# EAGLE design rpiz_test (EAGLE 7.7.0)
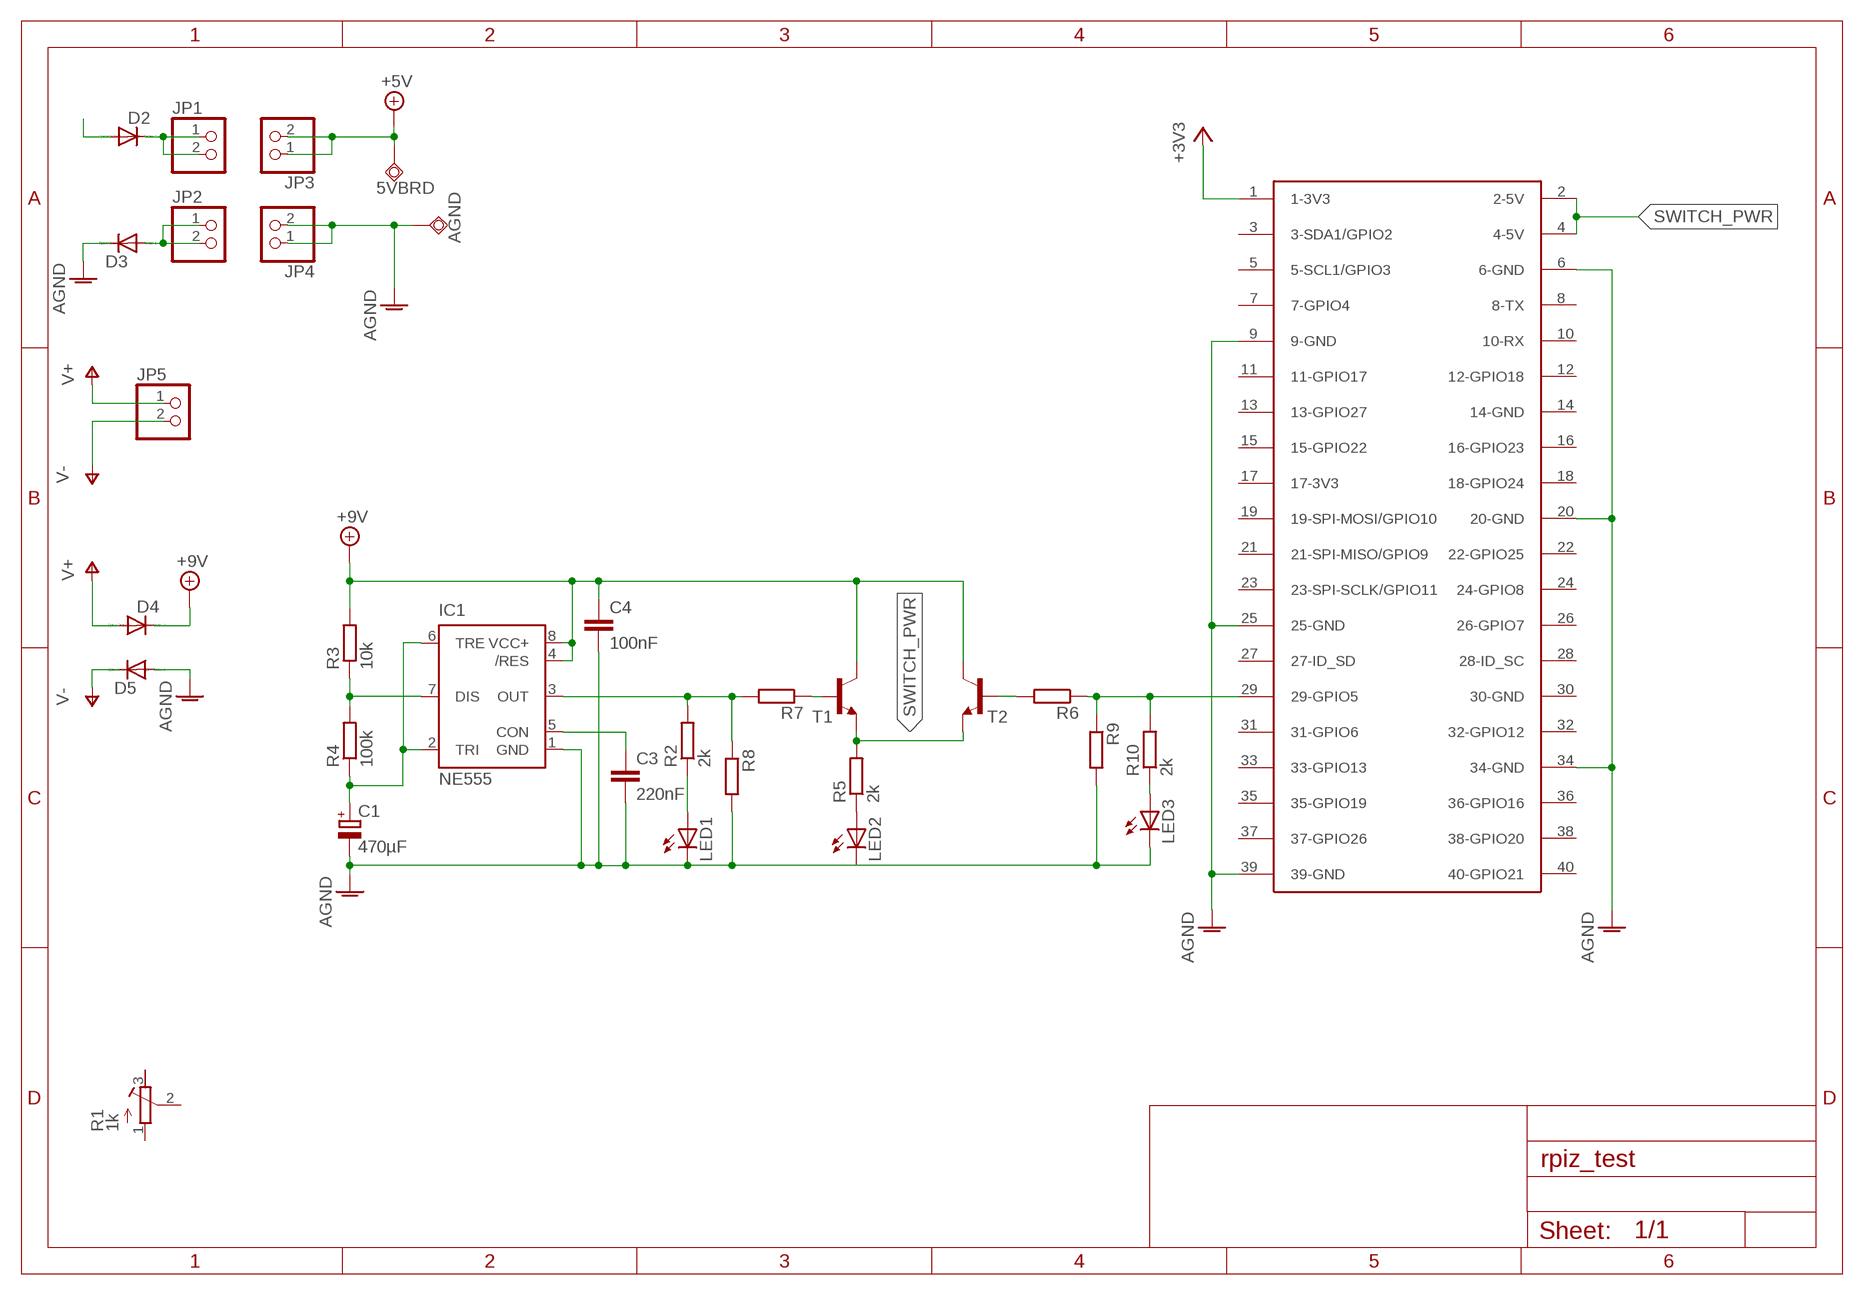
[diagram p0: schematic, sheet 1]

## Parts
5VBRD  TPSQTP20SQ  [TP20SQ]
AGND  TPSQTP20SQ  [TP20SQ]
C1  470µF  CPOL-EUE5-10.5  [E5-10,5]
C3  220nF  C-EU050-030X075  [C050-030X075]
C4  100nF  C-EU050-030X075  [C050-030X075]
D2  1N4148DO35-7  [DO35-7]
D3  1N4148DO35-7  [DO35-7]
D4  1N4148DO35-7  [DO35-7]
D5  1N4148DO35-7  [DO35-7]
IC1  NE555  [DIL-08]
JP1  PINHD-1X2  [1X02]
JP2  PINHD-1X2  [1X02]
JP3  PINHD-1X2  [1X02]
JP4  PINHD-1X2  [1X02]
JP5  PINHD-1X2  [1X02]
LED1  LED5MM  [LED5MM]
LED2  LED5MM  [LED5MM]
LED3  LED5MM  [LED5MM]
R1  1k  R-TRIMM64W  [RTRIM64W]
R2  2k  R-EU_0207/10  [0207/10]
R3  10k  R-EU_0207/10  [0207/10]
R4  100k  R-EU_0207/10  [0207/10]
R5  2k  R-EU_0207/10  [0207/10]
R6  R-EU_R0805  [R0805]
R7  R-EU_R0805  [R0805]
R8  R-EU_R0805  [R0805]
R9  R-EU_R0805  [R0805]
R10  2k  R-EU_0207/10  [0207/10]
T1  BC547-NPN-TO92-CBE  [TO92-CBE]
T2  BC547-NPN-TO92-CBE  [TO92-CBE]
U$1  RASPBERRY-PI+PIZERO  [RASPBERRY-PI-ZERO]

## Nets
+3V3: U$1.1(1-3V3)
+5V: 5VBRD.TP JP3.1 JP3.2
+9V: C4.1 D4.C IC1.4(/RES) IC1.8(VCC+) R3.2 T1.C T2.C
AGND: AGND.TP C1.- C3.2 C4.2 D3.C D5.A IC1.1(GND) JP4.1 JP4.2 LED1.K(C) LED2.K(C) LED3.K(C) R8.2 R9.2 U$1.6(6-GND) U$1.9(9-GND) U$1.20(20-GND) U$1.25(25-GND) U$1.34(34-GND) U$1.39(39-GND)
GPA0: IC1.3(OUT) R2.2 R7.2 R8.1
N$1: D2.C JP1.1 JP1.2
N$2: D3.A JP2.1 JP2.2
N$3: IC1.7(DIS) R3.1 R4.2
N$4: C1.+ IC1.2(TRI) IC1.6(TRE) R4.1
N$5: LED2.A R5.1
N$6: C3.1 IC1.5(CON)
N$7: R7.1 T1.B
N$8: D2.A
N$9: LED1.A R2.1
N$10: R6.2 T2.B
N$11: R6.1 R9.1 R10.2 U$1.29(29-GPIO5)
N$13: LED3.A R10.1
SWITCH_PWR: R5.2 T1.E T2.E U$1.2(2-5V) U$1.4(4-5V)
V+: D4.A JP5.1
V-: D5.C JP5.2
Unconnected: R1.1(A) R1.2(S) R1.3(E) U$1.3(3-SDA1/GPIO2) U$1.5(5-SCL1/GPIO3) U$1.7(7-GPIO4) U$1.8(8-TX) U$1.10(10-RX) U$1.11(11-GPIO17) U$1.12(12-GPIO18) U$1.13(13-GPIO27) U$1.14(14-GND) U$1.15(15-GPIO22) U$1.16(16-GPIO23) U$1.17(17-3V3) U$1.18(18-GPIO24) U$1.19(19-SPI-MOSI/GPIO10) U$1.21(21-SPI-MISO/GPIO9) U$1.22(22-GPIO25) U$1.23(23-SPI-SCLK/GPIO11) U$1.24(24-GPIO8) U$1.26(26-GPIO7) U$1.27(27-ID_SD) U$1.28(28-ID_SC) U$1.30(30-GND) U$1.31(31-GPIO6) U$1.32(32-GPIO12) U$1.33(33-GPIO13) U$1.35(35-GPIO19) U$1.36(36-GPIO16) U$1.37(37-GPIO26) U$1.38(38-GPIO20) U$1.40(40-GPIO21)

## Library data of the parts
5VBRD AGND = testpad:TPSQ: Test pad
C1 = rcl:CPOL-EU: POLARIZED CAPACITOR, European symbol
C3 C4 = rcl:C-EU: CAPACITOR, European symbol
D2-D5 = diode:1N4148: DIODE high speed (Philips)
IC1 = st-microelectronics:NE555: General purpose bipolar Timer; MF: Arrow Electronics; MPN: NE555N; OC_FARNELL: 1467742; OC_NEWARK: 89K1486
JP1-JP5 = pinhead:PINHD-1X2: PIN HEADER
LED1-LED3 = led:LED: LED OSRAM: - CHIPLED LG R971, LG N971, LY N971, LG Q971, LY Q971, LO R971, LY R971 LH N974, LH R974 LS Q976, LO Q976, LY Q976 LO Q996 - Hyper CHIPLED LW Q18S LB Q993, LB Q99A, LB R99A - SideLED LS A670, LO A670, LY A670, LG A670, LP A670 LB A673, LV A673, LT A673, LW A673 LH A674 LY A675 LS A676, LA A676, LO A676, LY A676, LW A676 LS A679, LY A679, LG A679 - Hyper Micro SIDELED® LS Y876, LA Y876, LO Y876, LY Y876 LT Y87S - SmartLED LW L88C, LW L88S LB L89C, LB L89S, LG L890 LS L89K, LO L89K, LY L89K LS L896, LA L896, LO L896, LY L896 - TOPLED LS T670, LO T670, LY T670, LG T670, LP T670 LSG T670, LSP T670, LSY T670, LOP T670, LYG T670 LG T671, LOG T671, LSG T671 LB T673, LV T673, LT T673, LW T673 LH T674 LS T676, LA T676, LO T676, LY T676, LB T676, LH T676, LSB T676, LW T676 LB T67C, LV T67C, LT T67C, LS T67K, LO T67K, LY T67K, LW E67C LS E67B, LA E67B, LO E67B, LY E67B, LB E67C, LV E67C, LT E67C LW T67C LS T679, LY T679, LG T679 LS T770, LO T770, LY T770, LG T770, LP T770 LB T773, LV T773, LT T773, LW T773 LH T774 LS E675, LA E675, LY E675, LS T675 LS T776, LA T776, LO T776, LY T776, LB T776 LHGB T686 LT T68C, LB T68C - Hyper Mini TOPLED® LB M676 - Mini TOPLED Santana® LG M470 LS M47K, LO M47K, LY M47K Source: http://www.osram.convergy.de LUXEON: - LUMILED® LXK2-PW12-R00, LXK2-PW12-S00, LXK2-PW14-U00, LXK2-PW14-V00 LXK2-PM12-R00, LXK2-PM12-S00, LXK2-PM14-U00 LXK2-PE12-Q00, LXK2-PE12-R00, LXK2-PE12-S00, LXK2-PE14-T00, LXK2-PE14-U00 LXK2-PB12-K00, LXK2-PB12-L00, LXK2-PB12-M00, LXK2-PB14-N00, LXK2-PB14-P00, LXK2-PB14-Q00 LXK2-PR12-L00, LXK2-PR12-M00, LXK2-PR14-Q00, LXK2-PR14-R00 LXK2-PD12-Q00, LXK2-PD12-R00, LXK2-PD12-S00 LXK2-PH12-R00, LXK2-PH12-S00 LXK2-PL12-P00, LXK2-PL12-Q00, LXK2-PL12-R00 Source: www.luxeon.com KINGBRIGHT: KA-3528ASYC Source: www.kingbright.com
R1 = rcl:R-TRIMM: Trimm resistor
R2-R10 = rcl:R-EU_: RESISTOR, European symbol
T1 T2 = transistor:*-NPN-: NPN Transistror BF959 corrected 2008.03.06
U$1 = Ava:RASPBERRY-PI+: Samtec SSW-120-01-T-D

## Board
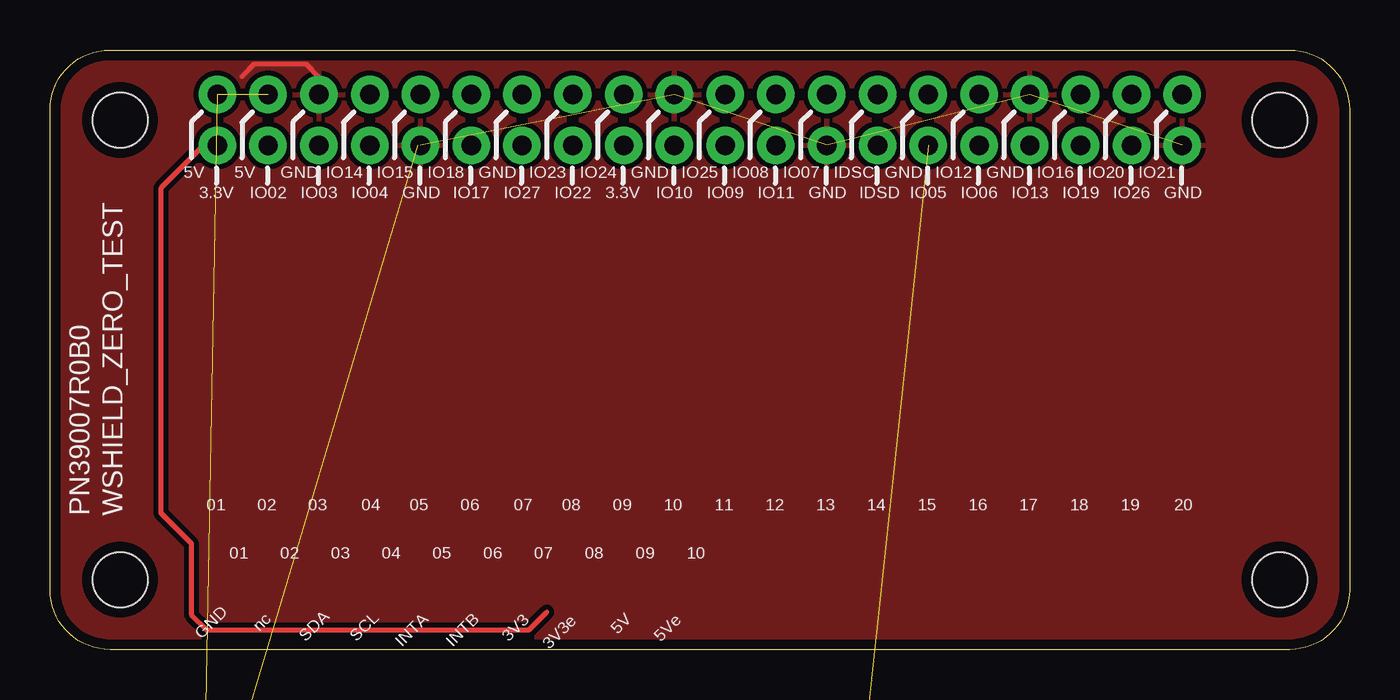
[diagram p1: board, top side]
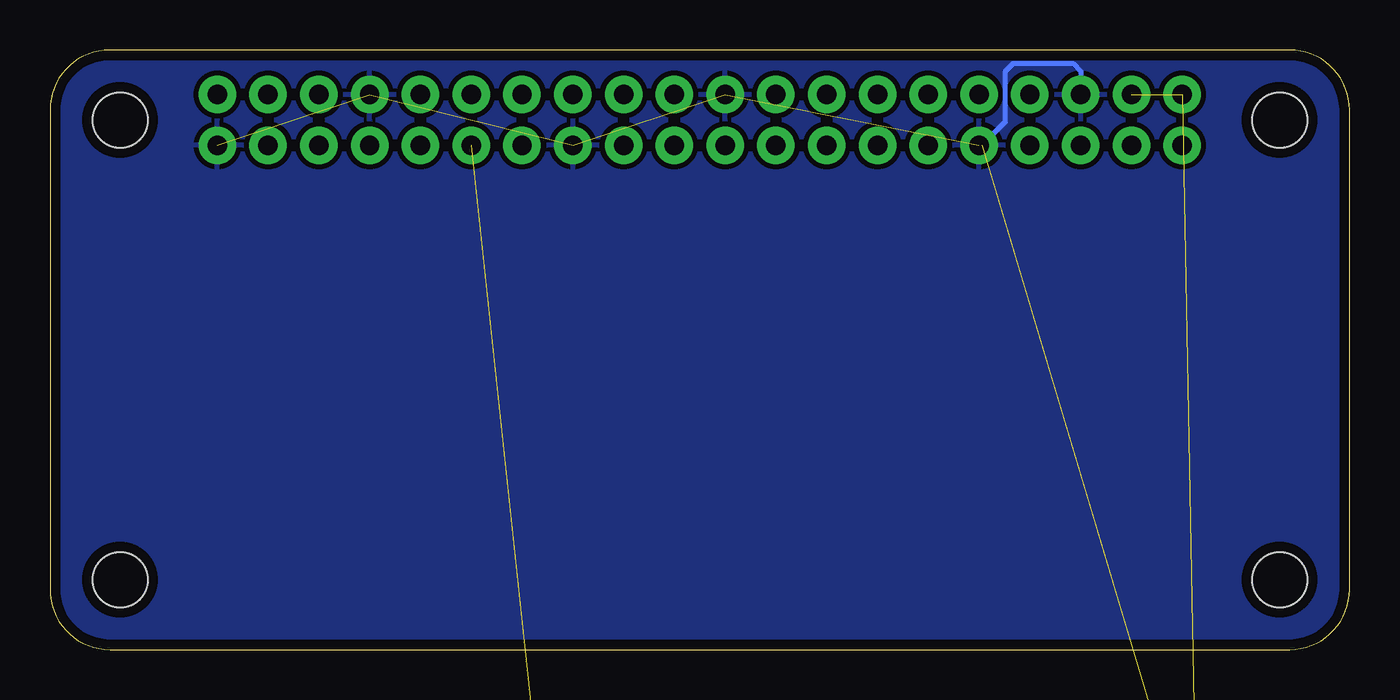
[diagram p2: board, bottom side, seen from below]

Size 65 x 30 mm. Coordinates in mm from the lower left corner, seen from the top.
Copper layers (1*16): Top 0.035mm / dielectric 1.6mm / Bottom 0.035mm
Design rules "Elecrow_2-layer_PCB_eagle_rule": minimum track width 6mil, minimum drill 12mil, track to track 6mil, track to pad 6mil, pad to pad 6mil, via to via 8mil, smd to smd 0mil, copper to edge 20mil, drill to drill 10mil, minimum pad ring 6mil, minimum via ring 6mil, stop-mask expansion 0mil, vias tented up to drill 100mil, thermal gap 10mil

### Footprints (pad centres in the part's own frame; a part is rotated, then mirrored left to right if it is on the bottom)
TP20SQ = smd 2 x 2: TP 0,0
E5-10,5 = drill 1.016 pad 2.54: + -2.54,0 | drill 1.016 pad 2.54 octagon: - 2.54,0
C050-030X075 = drill 0.813 octagon: 1 -2.54,0; 2 2.54,0
DO35-7 = drill 0.813 long: A 3.81,0; C -3.81,0
DIL-08 = drill 0.813 long: 1 -3.81,-3.81; 2 -1.27,-3.81; 3 1.27,-3.81; 4 3.81,-3.81; 5 3.81,3.81; 6 1.27,3.81; 7 -1.27,3.81; 8 -3.81,3.81
1X02 = drill 1.016 long: 1 -1.27,0; 2 1.27,0
LED5MM = drill 0.813 octagon: A -1.27,0; K 1.27,0
RTRIM64W = drill 0.61: 1 1.27,-2.54; 2 1.27,0; 3 1.27,2.54
0207/10 = drill 0.813 octagon: 1 -5.08,0; 2 5.08,0
R0805 = smd 1.3 x 1.5: 1 -0.95,0; 2 0.95,0
TO92-CBE = drill 0.813 long: B 0,0; C -2.54,0; E 2.54,0
RASPBERRY-PI-ZERO = drill 0.97 pad 1.88: 1 -23.97,23.23; 2 -23.97,25.77; 3 -21.43,23.23; 4 -21.43,25.77; 5 -18.89,23.23; 6 -18.89,25.77; 7 -16.35,23.23; 8 -16.35,25.77; 9 -13.81,23.23; 10 -13.81,25.77; 11 -11.27,23.23; 12 -11.27,25.77; 13 -8.73,23.23; 14 -8.73,25.77; 15 -6.19,23.23; 16 -6.19,25.77; 17 -3.65,23.23; 18 -3.65,25.77; 19 -1.11,23.23; 20 -1.11,25.77; 21 1.43,23.23; 22 1.43,25.77; 23 3.97,23.23; 24 3.97,25.77; 25 6.51,23.23; 26 6.51,25.77; 27 9.05,23.23; 28 9.05,25.77; 29 11.59,23.23; 30 11.59,25.77; 31 14.13,23.23; 32 14.14,25.77; 33 16.67,23.23; 34 16.67,25.77; 35 19.21,23.23; 36 19.21,25.77; 37 21.75,23.23; 38 21.75,25.77; 39 24.29,23.23; 40 24.29,25.77 | hole 2.75: -28.84,24.5; 29.16,24.5; -28.84,1.5; 29.16,1.5

### Placement (x,y rotation side)
5VBRD  -7.66,-295.69 0 top  (outside the outline)
5VBRD1  TPSQTP20SQ  [TP20SQ]  -7.66,-266.73 0 top  (outside the outline)
AGND  -7.66,-300.26 0 top  (outside the outline)
C1  14.43,-214.66 0 top  (outside the outline)
C2  220nF  [C050-030X075]  7.83,-233.46 0 top  (outside the outline)
C3  -2.33,-332.52 0 top  (outside the outline)
C4  -2.33,-344.71 0 top  (outside the outline)
D1  1N4148DO35-7  [DO35-7]  9.1,-195.87 0 top  (outside the outline)
D2  -1.06,-274.61 0 top  (outside the outline)
D3  -1.06,-286.8 0 top  (outside the outline)
D4  -1.06,-356.9 0 top  (outside the outline)
D5  -1.06,-369.09 0 top  (outside the outline)
IC1  9.1,-14.76 0 top  (outside the outline)
JP1  8.08,-32.29 0 top  (outside the outline)
JP2  8.08,-47.53 0 top  (outside the outline)
JP3  8.08,-62.77 0 top  (outside the outline)
JP4  8.08,-78.01 0 top  (outside the outline)
JP5  8.08,-93.25 0 top  (outside the outline)
LED1  -3.6,-460.03 0 top  (outside the outline)
LED2  -3.6,-435.64 0 top  (outside the outline)
LED3  -3.6,-507.78 0 top  (outside the outline)
R1  -6.9,-232.44 0 top  (outside the outline)
R2  0.21,-447.83 0 top  (outside the outline)
R3  0.21,-308.13 0 top  (outside the outline)
R4  0.21,-320.33 0 top  (outside the outline)
R5  0.21,-423.45 0 top  (outside the outline)
R6  -9.19,-481.36 0 top  (outside the outline)
R7  -9.19,-414.81 0 top  (outside the outline)
R8  -4.87,-414.81 0 top  (outside the outline)
R9  -9.19,-486.95 0 top  (outside the outline)
R10  0.21,-495.59 0 top  (outside the outline)
T1  -2.33,-405.67 0 top  (outside the outline)
T2  -2.33,-472.22 0 top  (outside the outline)
U$1  32.34,2 0 top

### Tracks (layer width: path | path; a pad name or v marks a point on that pad's centre or on a via)
+3V3
  Top 0.254: U$1.1 7.69,25.23 5.54,23.08 5.54,6.83 7.07,5.3 7.07,1.75 7.83,0.98 23.96,0.98 24.85,1.87
+5V  (2 unrouted)
+9V  (6 unrouted)
AGND  (18 unrouted)
  Top 0.254: 9.61,28.67 10.24,29.3 12.78,29.3 13.42,28.67 13.42,27.8 U$1.6
  Bottom 0.254: U$1.6 13.42,27.8 13.42,28.92 13.8,29.3 16.85,29.3 17.23,28.92 17.23,26.38 18.38,25.23 U$1.9
  pour Top (isolate 0.254): 0.08,27.02 arc-90 3.26,30.19 3.89,30.19 62.31,30.19 arc-90 64.85,27.65 64.85,27.02 64.85,2.89 arc-90 62.31,0.35 61.68,0.35 3.26,0.35 arc-90 0.08,3.52
  pour Bottom (isolate 0.254): 0.08,27.02 arc-90 3.26,30.19 3.89,30.19 62.31,30.19 arc-90 64.85,27.65 64.85,2.89 arc-90 62.31,0.35 61.68,0.35 3.26,0.35 arc-90 0.08,3.52
GPA0  (3 unrouted)
N$1  (2 unrouted)
N$2  (2 unrouted)
N$3  (2 unrouted)
N$4  (3 unrouted)
N$5  (1 unrouted)
N$6  (1 unrouted)
N$7  (1 unrouted)
N$9  (1 unrouted)
N$10  (1 unrouted)
N$11  (3 unrouted)
N$13  (1 unrouted)
SWITCH_PWR  (4 unrouted)
V+  (1 unrouted)
V-  (1 unrouted)

### Text on the board
tNames: 5V | 5V | GND | IO14 | IO15 | IO18 | GND | IO23 | IO24 | GND | IO25 | IO08 | IO07 | IDSC | GND | IO12 | GND | IO16 | IO20 | IO21 | 3.3V | IO02 | IO03 | IO04 | GND | IO17 | IO27 | IO22 | 3.3V | IO10 | IO09 | IO11 | GND | IDSD | IO05 | IO06 | IO13 | IO19 | IO26 | GND | PN39007R0B0 | WSHIELD_ZERO_TEST | 01 | 02 | 03 | 04 | 05 | 06 | 07 | 08 | 09 | 10 | 11 | 12 | 13 | 14 | 15 | 16 | 17 | 18 | 19 | 20 | 01 | 02 | 03 | 04 | 05 | 06 | 07 | 08 | 09 | 10 | GND | nc | SDA | SCL | 3V3 | 5V | 5Ve | INTA | INTB | 3V3e